# Altium schematic sheet ADC.SchDoc
size A4; CompanyName: Technische Hochschule Nürnberg Georg Simon Ohm; Organization: UltraZohm; Address1: Kesslerplatz 12; Address2: 90489 Nürnberg; Address3: GERMANY; DocumentNumber: 6; SheetNumber: 6; SheetTotal: 6; Website: www.ultrazohm.com
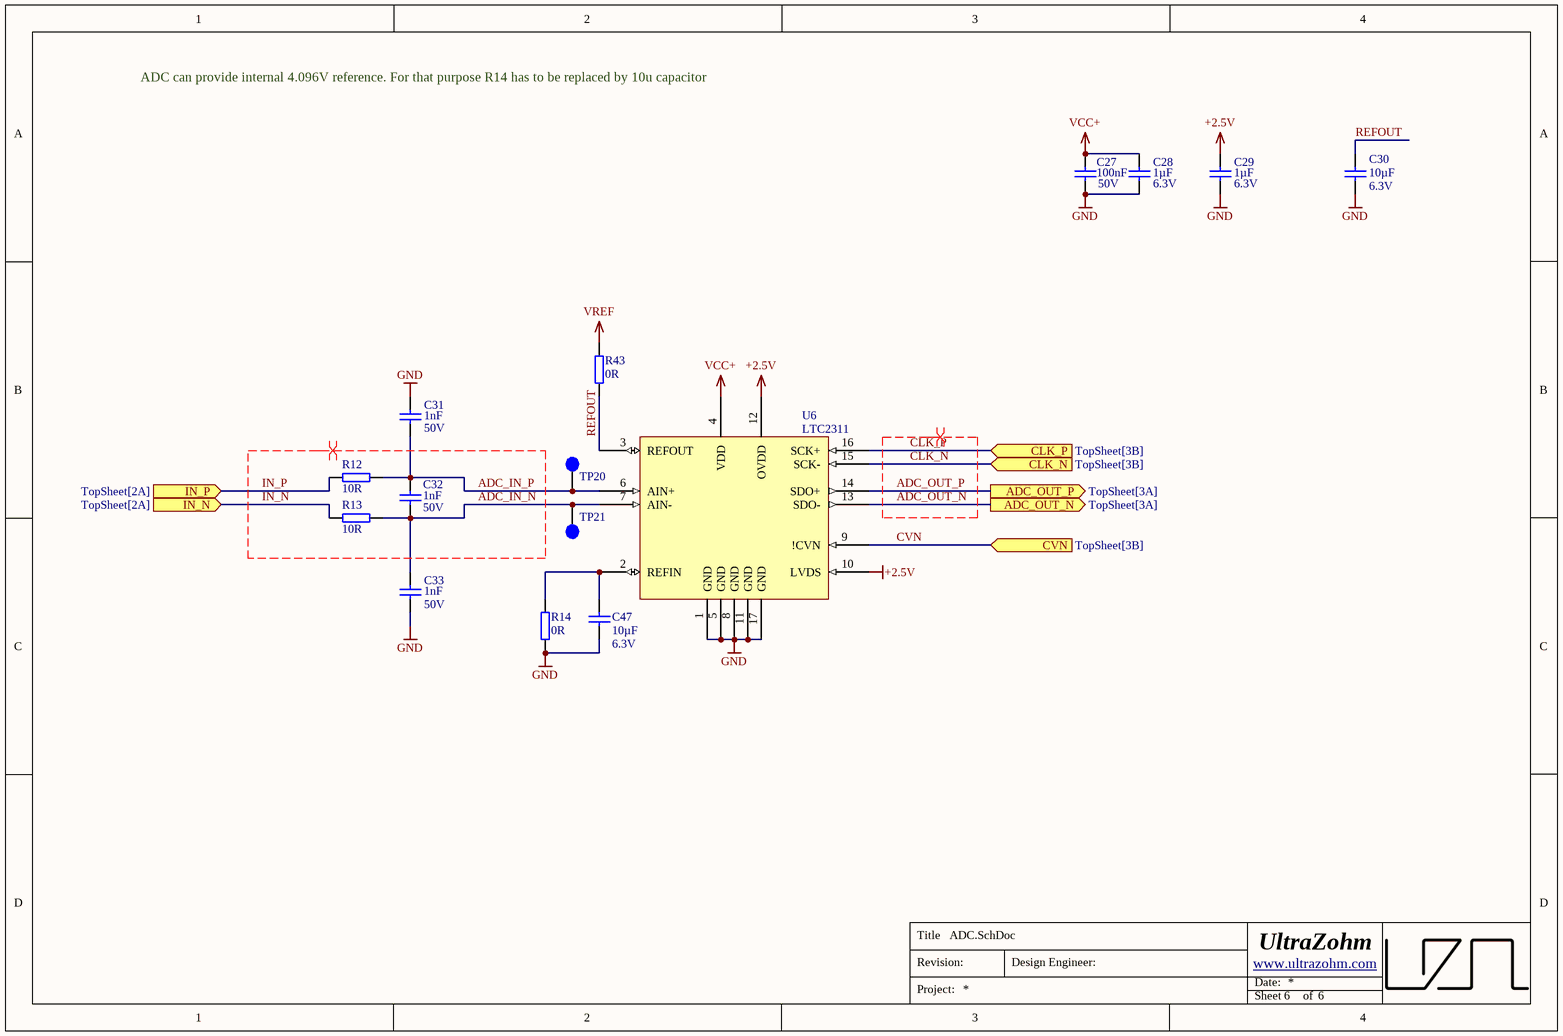
[diagram p0: ADC.SchDoc]

## Parts
C27  100nF  Voltage: 50V  [CAPC1608X07N]
C28  1µF  Voltage: 6.3V  [CAPC1608X07N]
C29  1µF  Voltage: 6.3V  [CAPC1608X07N]
C30  10µF  Voltage: 6.3V  [Cap0805]
C31  1nF  Voltage: 50V  [CAPC1608X07N]
C32  1nF  Voltage: 50V  [CAPC1608X07N]
C33  1nF  Voltage: 50V  [CAPC1608X07N]
C47  10µF  Voltage: 6.3V  [Cap0805]
R12  10R  [RESC1608X06N]
R13  10R  [RESC1608X06N]
R14  0R  [RESC1608X06N]
R43  0R  [RESC1608X06N]
TP20  +  [TP_1mm]  (value not drawn)  (no BOM)
TP21  -  [TP_1mm]  (value not drawn)  (no BOM)
U6  LTC2311  [TSSOP50P510X110_HS-17N]

## Ports
ADC_OUT_N (out, see TopSheet[3A]), ADC_OUT_P (out, see TopSheet[3A]), CLK_N (in, see TopSheet[3B]), CLK_P (in, see TopSheet[3B]), CVN (in, see TopSheet[3B]), IN_N (in, see TopSheet[2A]), IN_P (in, see TopSheet[2A])

## Nets
+2.5V: C29.1 U6.10(LVDS) U6.12(OVDD)
GND: C27.2 C28.2 C29.2 C30.2 C31.1 C33.2 C47.2 R14.1 U6.1(GND) U6.5(GND) U6.8(GND) U6.11(GND) U6.17(GND)
VCC+: C27.1 C28.1 U6.4(VDD)
VREF: R43.2
ADC_IN_N: C32.2 C33.1 R13.2 TP21.1 U6.7(AIN-)
ADC_IN_P: C31.2 C32.1 R12.2 TP20.1 U6.6(AIN+)
ADC_OUT_N: U6.13(SDO-) ; port ADC_OUT_N
ADC_OUT_P: U6.14(SDO+) ; port ADC_OUT_P
CLK_N: U6.15(SCK-) ; port CLK_N
CLK_P: U6.16(SCK+) ; port CLK_P
CVN: U6.9(!CVN) ; port CVN
IN_N: R13.1 ; port IN_N
IN_P: R12.1 ; port IN_P
REFOUT: C30.1 R43.1 U6.3(REFOUT)
NetC47_1: C47.1 R14.2 U6.2(REFIN)

## Layout directives
differential pair: ADC_IN_N, ADC_IN_P, ADC_OUT_N, ADC_OUT_P, CLK_N, CLK_P, IN_N, IN_P

## Notes on the sheet
- ADC can provide internal 4.096V reference. For that purpose R14 has to be replaced by 10u capacitor
- Title
- Revision:
- Design Engineer:
- Date:
- Project:
- Sheet
- of

## Library data of the parts
C27 = Cap_0603: MPN: CC0603KRX7R9BB104; MF: Yageo; Dielectric: X5R; Value: 100nF; Supplier 1: Mouser; Supplier 2: Mouser; Supplier Part Number 1: 603-CC603KRX7R9BB104; Supplier Part Number 2: 710-885382206004; Package: 0603
C28 C29 = Cap_0603: MPN: JMK107BJ105MA-T; MF: Taiyo Yuden; Dielectric: X5R; Value: 1µF; Supplier 1: Mouser; Supplier Part Number 1: 963-JMK107BJ105MA-T; Package: 0603
C30 C47 = Cap0805: CAP CER 0805; MPN: CL21A106KQFNNNE; MF: Samsung Electro-Mechanics; Dielectric: X5R; Supplier 1: Mouser; Supplier 2: *; Supplier Part Number 1: 187-CL21A106KQFNNNE; Supplier Part Number 2: *; Package: 0805; Value: 10µF
C31-C33 = Cap_0603: MPN: GRM1885C1H102GA1D; MF: Murata; Dielectric: NP0; Value: 1nF; Supplier 1: Mouser; Supplier 2: Mouser; Supplier Part Number 1: 81-GRM1885C1H102GA1D; Supplier Part Number 2: 81-GRM1885C1H102GA1J; Package: 0603
R12 R13 = R_0603: MPN: RC0603FR-0710RL; MF: Yageo; Value: 10R; Supplier 1: Mouser; Supplier Part Number 1: 603-RC0603FR-0710RL; Package: 0603
R14 R43 = R_0603: MPN: CRCW06030000Z0EBC; MF: Vishay / Dale; Value: 0R; Supplier 1: Mouser; Supplier Part Number 1: 71-CRCW06030000Z0EBC; Package: 0603
TP20 TP21 = TP_1mm: Testpoint 1mm; Created: 2018_06_25_AGeiger
  TP20: Value: +
  TP21: Value: -
U6 = LTC2311-16: 16 Bit SAR ADC, 5MSps; MPN: LTC2311CMSE-16#PBF; MF: Analog Devices; Package: MSOP-16; Supplier 1: Mouser; Supplier 2: Digi-Key; Supplier Part Number 1: 584-C2311CMSE-16PBF; Supplier Part Number 2: LTC2311CMSE-16#PBF-ND; ComponentLink1Description: Manufacturer; ComponentLink1URL: https://www.analog.com/en/index.html; ComponentLink2Description: Datasheet; ComponentLink2URL: https://www.analog.com/media/en/technical-documentation/data-sheets/231116fa.pdf